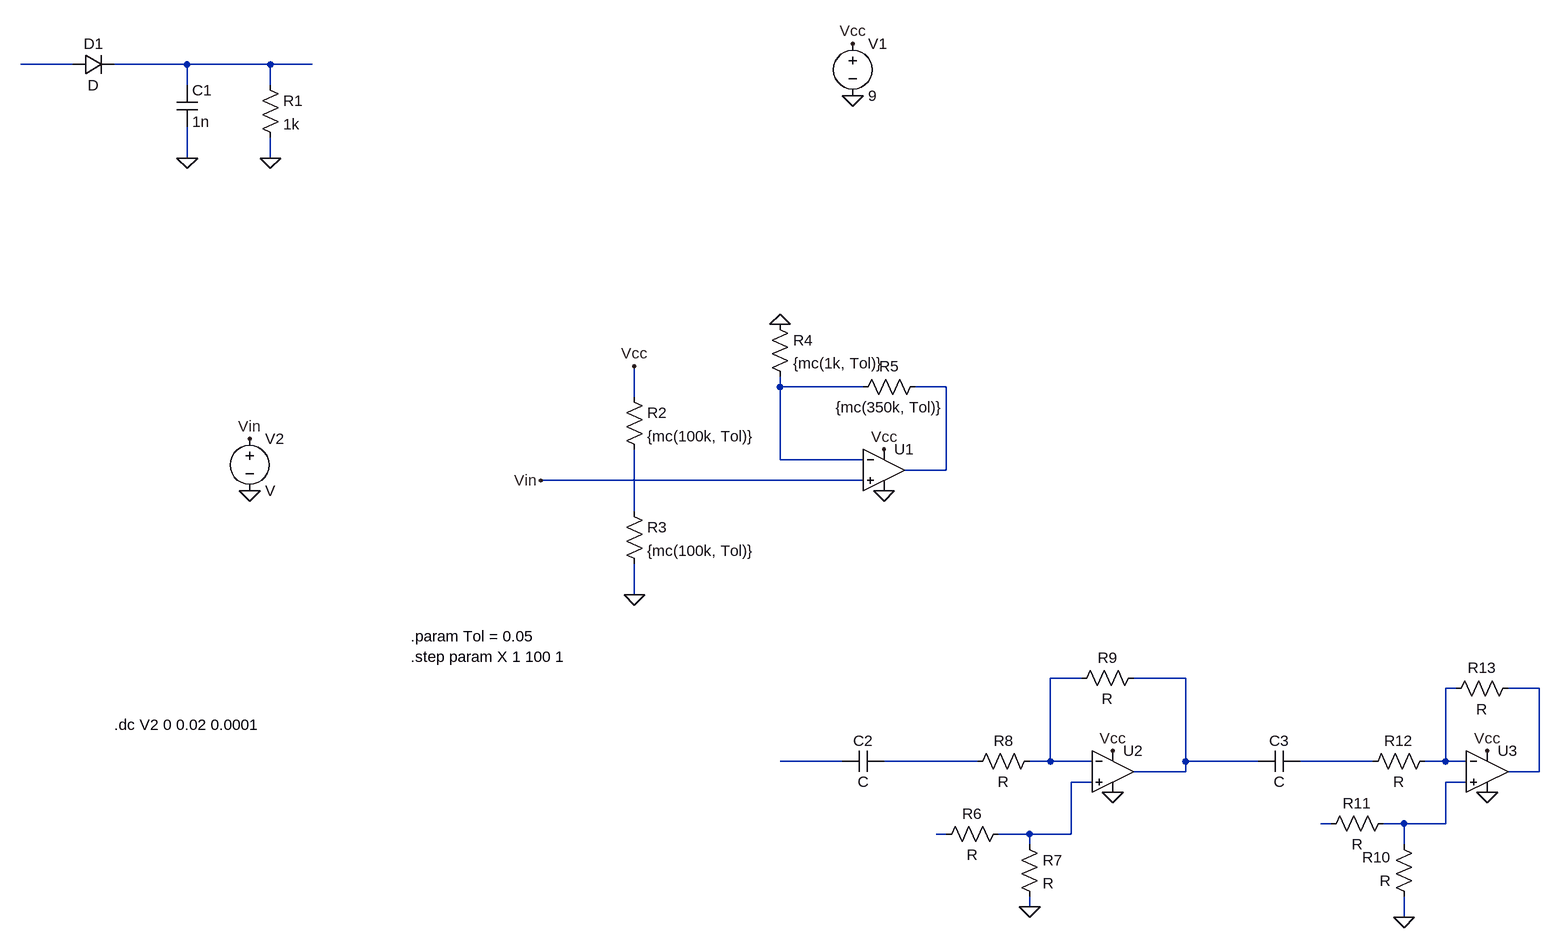
[diagram p0: schematic peakdetector.asc]
peakdetector.asc, the LTspice schematic file:
Version 4
SHEET 1 2868 1608
WIRE 256 256 176 256
WIRE 432 256 320 256
WIRE 560 256 432 256
WIRE 624 256 560 256
WIRE 432 288 432 256
WIRE 560 288 560 256
WIRE 432 400 432 352
WIRE 560 400 560 368
WIRE 1344 752 1344 736
WIRE 1472 752 1344 752
WIRE 1600 752 1552 752
WIRE 1120 768 1120 720
WIRE 1344 864 1344 752
WIRE 1472 864 1344 864
WIRE 1600 880 1600 752
WIRE 1600 880 1536 880
WIRE 1472 896 976 896
WIRE 1120 944 1120 848
WIRE 1120 1072 1120 1024
WIRE 1808 1200 1760 1200
WIRE 1968 1200 1888 1200
WIRE 2384 1216 2368 1216
WIRE 2512 1216 2464 1216
WIRE 1440 1328 1344 1328
WIRE 1648 1328 1504 1328
WIRE 1760 1328 1760 1200
WIRE 1760 1328 1728 1328
WIRE 1824 1328 1760 1328
WIRE 1968 1328 1968 1200
WIRE 2080 1328 1968 1328
WIRE 2256 1328 2144 1328
WIRE 2368 1328 2368 1216
WIRE 2368 1328 2336 1328
WIRE 2400 1328 2368 1328
WIRE 1968 1344 1968 1328
WIRE 1968 1344 1888 1344
WIRE 2512 1344 2512 1216
WIRE 2512 1344 2464 1344
WIRE 1824 1360 1792 1360
WIRE 2400 1360 2368 1360
WIRE 2192 1424 2176 1424
WIRE 2304 1424 2272 1424
WIRE 2368 1424 2368 1360
WIRE 2368 1424 2304 1424
WIRE 1600 1440 1584 1440
WIRE 1728 1440 1680 1440
WIRE 1792 1440 1792 1360
WIRE 1792 1440 1728 1440
WIRE 1728 1456 1728 1440
WIRE 2304 1456 2304 1424
WIRE 1728 1552 1728 1536
WIRE 2304 1568 2304 1536
FLAG 432 400 0
FLAG 560 400 0
FLAG 1120 1072 0
FLAG 1344 656 0
FLAG 1504 912 0
FLAG 1456 304 0
FLAG 1456 224 Vcc
FLAG 1504 848 Vcc
FLAG 1120 720 Vcc
FLAG 528 912 0
FLAG 528 832 Vin
FLAG 976 896 Vin
FLAG 1728 1552 0
FLAG 2304 1568 0
FLAG 1856 1376 0
FLAG 2432 1376 0
FLAG 1856 1312 Vcc
FLAG 2432 1312 Vcc
SYMBOL Diode 256 272 R270
WINDOW 0 32 32 VTop 2
WINDOW 3 0 32 VBottom 2
SYMATTR InstName D1
SYMBOL Cap 416 288 R0
SYMATTR InstName C1
SYMATTR Value 1n
SYMBOL Res 544 272 R0
SYMATTR InstName R1
SYMATTR Value 1k
SYMBOL UniversalOpAmp2 1504 880 R0
SYMATTR InstName U1
SYMBOL Res 1104 752 R0
SYMATTR InstName R2
SYMATTR Value {mc(100k, Tol)}
SYMBOL Res 1104 928 R0
SYMATTR InstName R3
SYMATTR Value {mc(100k, Tol)}
SYMBOL Res 1328 640 R0
SYMATTR InstName R4
SYMATTR Value {mc(1k, Tol)}
SYMBOL Res 1568 736 R90
WINDOW 0 0 56 VBottom 2
WINDOW 3 32 56 VTop 2
SYMATTR InstName R5
SYMATTR Value {mc(350k, Tol)}
SYMBOL Voltage 1456 208 R0
SYMATTR InstName V1
SYMATTR Value 9
SYMBOL Voltage 528 816 R0
SYMATTR InstName V2
SYMBOL UniversalOpAmp2 1856 1344 R0
SYMATTR InstName U2
SYMBOL UniversalOpAmp2 2432 1344 R0
SYMATTR InstName U3
SYMBOL Res 1696 1424 R90
WINDOW 0 0 56 VBottom 2
WINDOW 3 32 56 VTop 2
SYMATTR InstName R6
SYMBOL Res 1712 1440 R0
SYMATTR InstName R7
SYMBOL Res 1744 1312 R90
WINDOW 0 0 56 VBottom 2
WINDOW 3 32 56 VTop 2
SYMATTR InstName R8
SYMBOL Res 1904 1184 R90
WINDOW 0 0 56 VBottom 2
WINDOW 3 32 56 VTop 2
SYMATTR InstName R9
SYMBOL Res 2320 1552 R180
WINDOW 0 36 76 Left 2
WINDOW 3 36 40 Left 2
SYMATTR InstName R10
SYMBOL Res 2176 1440 R270
WINDOW 0 32 56 VTop 2
WINDOW 3 0 56 VBottom 2
SYMATTR InstName R11
SYMBOL Res 2240 1344 R270
WINDOW 0 32 56 VTop 2
WINDOW 3 0 56 VBottom 2
SYMATTR InstName R12
SYMBOL Res 2368 1232 R270
WINDOW 0 32 56 VTop 2
WINDOW 3 0 56 VBottom 2
SYMATTR InstName R13
SYMBOL Cap 1504 1312 R90
WINDOW 0 0 32 VBottom 2
WINDOW 3 32 32 VTop 2
SYMATTR InstName C2
SYMBOL Cap 2144 1312 R90
WINDOW 0 0 32 VBottom 2
WINDOW 3 32 32 VTop 2
SYMATTR InstName C3
TEXT 320 1272 Left 2 !.dc V2 0 0.02 0.0001
TEXT 776 1136 Left 2 !.param Tol = 0.05\n.step param X 1 100 1

The netlist it stands for:
* peakdetector.asc
D1 N001 N002 D
C1 N002 0 1n
R1 N002 0 1k
XU1 Vin N003 Vcc 0 N004 level2 Avol=1Meg GBW=10Meg Slew=10Meg Ilimit=25m Rail=0 Vos=0 En=0 Enk=0 In=0 Ink=0 Rin=500Meg  ; pins In+ In- V+ V- OUT
R2 Vcc N005 {mc(100k, Tol)}
R3 N005 0 {mc(100k, Tol)}
R4 0 N003 {mc(1k, Tol)}
R5 N004 N003 {mc(350k, Tol)}
V1 Vcc 0 9
V2 Vin 0 V
XU2 N013 N006 Vcc 0 N007 level2 Avol=1Meg GBW=10Meg Slew=10Meg Ilimit=25m Rail=0 Vos=0 En=0 Enk=0 In=0 Ink=0 Rin=500Meg  ; pins In+ In- V+ V- OUT
XU3 N014 N008 Vcc 0 N009 level2 Avol=1Meg GBW=10Meg Slew=10Meg Ilimit=25m Rail=0 Vos=0 En=0 Enk=0 In=0 Ink=0 Rin=500Meg  ; pins In+ In- V+ V- OUT
R6 N013 N016 R
R7 N013 0 R
R8 N006 N011 R
R9 N007 N006 R
R10 0 N014 R
R11 N015 N014 R
R12 N012 N008 R
R13 N008 N009 R
C2 N011 N010 C
C3 N012 N007 C
.model D D
.lib standard.dio
.dc V2 0 0.02 0.0001
.param Tol = 0.05
.step param X 1 100 1
.lib UniversalOpAmp2.lib
.backanno
.end